# Altium project FMU3_REV_E.PrjPcb (part 2 of 2)
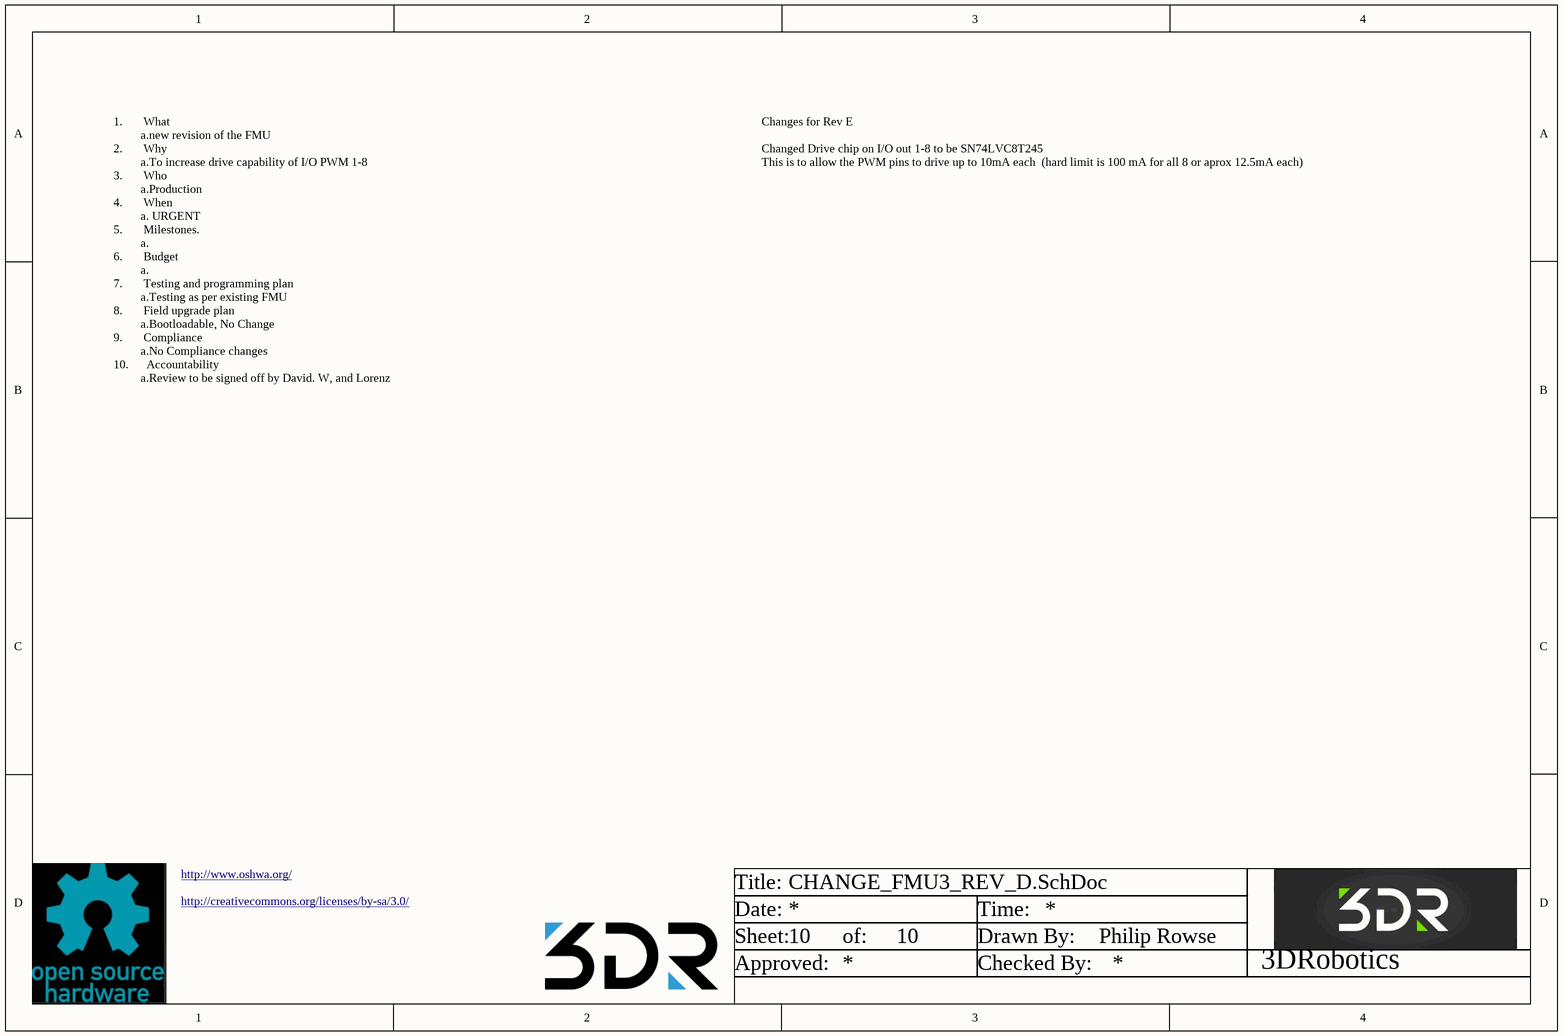
[diagram p11: CHANGE_FMU3_REV_D.SchDoc]

## Nets that join several sheets
GND: FMU_FMU3_REV_C (8 pins), SD_USB_FMU3_REV_C (9 pins), SERIAL_FMU3_REV_C (12 pins), SENSORS_FMU3_REV_C (23 pins), FMU_Power_FMU3_REV_C (25 pins), LEDs_FMU3_REV_C (Q6001.2 R6017.P$2), IO_FMU3_REV_C (15 pins), PWM_PPM_FMU3_REV_E (12 pins), 80PIN_FMU3_REV_E (6 pins), IO_PWR_FMU3_REV_C (13 pins)
~{ACCEL_MAG_EXT_CS}: FMU_FMU3_REV_C (U1001.9), SENSORS_FMU3_REV_C (U$2.2)
ALARM: FMU_FMU3_REV_C (U1001.77), 80PIN_FMU3_REV_E (U$9001.24)
AUX_BATT_CURRENT_SENS: SD_USB_FMU3_REV_C (RN2002.9), 80PIN_FMU3_REV_E (U$9001.25)
AUX_BATT_VOLTAGE_SENS: SD_USB_FMU3_REV_C (RN2002.10), 80PIN_FMU3_REV_E (U$9001.23)
~{BARO_CS}: FMU_FMU3_REV_C (U1001.88), SENSORS_FMU3_REV_C (U4003.5)
~{BARO_EXT_CS}: FMU_FMU3_REV_C (U1001.8), SENSORS_FMU3_REV_C (U$2.1)
BATT_CURRENT_SENS: FMU_FMU3_REV_C (U1001.26), SD_USB_FMU3_REV_C (RN2002.16)
BATT_CURRENT_SENS_PROT: SD_USB_FMU3_REV_C (L2001.P$1 R2004.P$1), 80PIN_FMU3_REV_E (U$9001.49)
BATT_VOLTAGE_SENS: FMU_FMU3_REV_C (U1001.25), SD_USB_FMU3_REV_C (RN2002.15)
BATT_VOLTAGE_SENS_PROT: SD_USB_FMU3_REV_C (L2002.P$1 R2003.P$1), 80PIN_FMU3_REV_E (U$9001.47)
CAN1_RX: FMU_FMU3_REV_C (U1001.81), SERIAL_FMU3_REV_C (U3004.4)
CAN1_TX: FMU_FMU3_REV_C (U1001.82), SERIAL_FMU3_REV_C (U3004.1)
CAN2_RX: FMU_FMU3_REV_C (U1001.51), SERIAL_FMU3_REV_C (U3003.4)
CAN2_TX: FMU_FMU3_REV_C (U1001.92), SERIAL_FMU3_REV_C (U3003.1)
CAN_H_1: SERIAL_FMU3_REV_C (R3010.P$1 U3004.7), 80PIN_FMU3_REV_E (U$9001.79)
CAN_H_2: SERIAL_FMU3_REV_C (R3009.P$1 U3003.7), 80PIN_FMU3_REV_E (U$9001.41)
CAN_L_1: SERIAL_FMU3_REV_C (R3010.P$2 U3004.6), 80PIN_FMU3_REV_E (U$9001.77)
CAN_L_2: SERIAL_FMU3_REV_C (R3009.P$2 U3003.6), 80PIN_FMU3_REV_E (U$9001.39)
~{EXTERN_CS}: FMU_FMU3_REV_C (U1001.36), 80PIN_FMU3_REV_E (U$9001.5)
EXTERN_DRDY: FMU_FMU3_REV_C (U1001.35), 80PIN_FMU3_REV_E (U$9001.11)
~{FMU-LED_AMBER}: FMU_FMU3_REV_C (U1001.43), LEDs_FMU3_REV_C (R6013.P$1), 80PIN_FMU3_REV_E (U$9001.2)
FMU-!RESET: FMU_Power_FMU3_REV_C (C5015.P$2 U1001.14 U5001.3), 80PIN_FMU3_REV_E (U$9001.7)
FMU-CH1: FMU_FMU3_REV_C (U1001.45), PWM_PPM_FMU3_REV_E (U8001.1)
FMU-CH1-PROT: PWM_PPM_FMU3_REV_E (RN8002.16), 80PIN_FMU3_REV_E (U$9001.50)
FMU-CH2: FMU_FMU3_REV_C (U1001.44), PWM_PPM_FMU3_REV_E (U8001.3)
FMU-CH2-PROT: PWM_PPM_FMU3_REV_E (RN8002.15), 80PIN_FMU3_REV_E (U$9001.52)
FMU-CH3: FMU_FMU3_REV_C (U1001.42), PWM_PPM_FMU3_REV_E (U8001.4)
FMU-CH3-PROT: PWM_PPM_FMU3_REV_E (RN8002.14), 80PIN_FMU3_REV_E (U$9001.54)
FMU-CH4: FMU_FMU3_REV_C (U1001.40), PWM_PPM_FMU3_REV_E (U8001.5)
FMU-CH4-PROT: PWM_PPM_FMU3_REV_E (RN8002.13), 80PIN_FMU3_REV_E (U$9001.56)
FMU-CH5: FMU_FMU3_REV_C (U1001.60), PWM_PPM_FMU3_REV_E (U8001.6)
FMU-CH5-PROT: PWM_PPM_FMU3_REV_E (RN8002.12), 80PIN_FMU3_REV_E (U$9001.58)
FMU-CH6: FMU_FMU3_REV_C (U1001.61), PWM_PPM_FMU3_REV_E (U8001.7)
FMU-CH6-PROT: PWM_PPM_FMU3_REV_E (RN8002.11), 80PIN_FMU3_REV_E (U$9001.60)
FMU-I2C1_SCL: FMU_FMU3_REV_C (U1001.95), SERIAL_FMU3_REV_C (R3002.P$1 R3007.P$1)
FMU-I2C1_SDA: FMU_FMU3_REV_C (U1001.96), SERIAL_FMU3_REV_C (R3004.P$1 R3008.P$1)
FMU-I2C2_SCL: FMU_FMU3_REV_C (U1001.47), SERIAL_FMU3_REV_C (R3001.P$1 R3005.P$1)
FMU-I2C2_SDA: FMU_FMU3_REV_C (U1001.48), SERIAL_FMU3_REV_C (R3003.P$1 R3006.P$1)
FMU-SWCLK: FMU_FMU3_REV_C (U1001.76), 80PIN_FMU3_REV_E (FMU-SWCLK.P$1 U$9001.3)
FMU-SWDIO: FMU_FMU3_REV_C (U1001.72), 80PIN_FMU3_REV_E (FMU-SWDIO.P$1 U$9001.1)
FMU-UART4_RX: FMU_FMU3_REV_C (U1001.24), SERIAL_FMU3_REV_C (U3001.8)
FMU-UART4_TX: FMU_FMU3_REV_C (U1001.23), SERIAL_FMU3_REV_C (U3001.9)
FMU-UART7_RX: FMU_FMU3_REV_C (U1001.38), SERIAL_FMU3_REV_C (U3001.4)
FMU-UART7_TX: FMU_FMU3_REV_C (U1001.39), SERIAL_FMU3_REV_C (U3001.5)
FMU-UART8_RX: FMU_FMU3_REV_C (U1001.97), SERIAL_FMU3_REV_C (U3001.6)
FMU-UART8_TX: FMU_FMU3_REV_C (U1001.98), SERIAL_FMU3_REV_C (U3001.7)
FMU-USART2_CTS: FMU_FMU3_REV_C (U1001.84), SERIAL_FMU3_REV_C (U3002.9)
FMU-USART2_RTS: FMU_FMU3_REV_C (U1001.85), SERIAL_FMU3_REV_C (U3002.8)
FMU-USART2_RX: FMU_FMU3_REV_C (U1001.87), SERIAL_FMU3_REV_C (U3002.6)
FMU-USART2_TX: FMU_FMU3_REV_C (U1001.86), SERIAL_FMU3_REV_C (U3002.7)
FMU-USART3_CTS: FMU_FMU3_REV_C (U1001.58), SERIAL_FMU3_REV_C (U3002.3)
FMU-USART3_RTS: FMU_FMU3_REV_C (U1001.59), SERIAL_FMU3_REV_C (U3002.1)
FMU-USART3_RX: FMU_FMU3_REV_C (U1001.56), SERIAL_FMU3_REV_C (U3002.4)
FMU-USART3_TX: FMU_FMU3_REV_C (U1001.55), SERIAL_FMU3_REV_C (U3002.5)
FMU-VDD_3V3: FMU_FMU3_REV_C (5 pins), SD_USB_FMU3_REV_C (6 pins), SERIAL_FMU3_REV_C (14 pins), SENSORS_FMU3_REV_C (R4002.P$2), FMU_Power_FMU3_REV_C (13 pins), IO_FMU3_REV_C (R7012.P$2), PWM_PPM_FMU3_REV_E (C8002.P$1 U8001.2 U8001.10 U8001.19), 80PIN_FMU3_REV_E (FMU-VDD_3V3.P$1)
FMU_AUX_ADC2: FMU_FMU3_REV_C (U1001.33), SD_USB_FMU3_REV_C (RN2002.8)
FMU_AUX_POWER_ADC1: FMU_FMU3_REV_C (U1001.18), SD_USB_FMU3_REV_C (RN2002.7)
~{GYRO_EXT_CS}: FMU_FMU3_REV_C (U1001.7), SENSORS_FMU3_REV_C (U$2.6)
I2C_1_SCL: SERIAL_FMU3_REV_C (R3007.P$2), 80PIN_FMU3_REV_E (U$9001.37)
I2C_1_SDA: SERIAL_FMU3_REV_C (R3008.P$2), 80PIN_FMU3_REV_E (U$9001.35)
I2C_2_SCL: SERIAL_FMU3_REV_C (R3005.P$2), 80PIN_FMU3_REV_E (U$9001.6)
I2C_2_SDA: SERIAL_FMU3_REV_C (R3006.P$2), 80PIN_FMU3_REV_E (U$9001.4)
I/O_POWER_BREATHING: LEDs_FMU3_REV_C (R6001.P$2), IO_FMU3_REV_C (U7001.32)
~{IO-LED_AMBER}: LEDs_FMU3_REV_C (R6015.P$1), IO_FMU3_REV_C (U7001.28)
~{IO-LED_SAFET_PROT}: LEDs_FMU3_REV_C (R6016.P$1), 80PIN_FMU3_REV_E (U$9001.28)
~{IO-LED_SAFETY}: LEDs_FMU3_REV_C (R6016.P$2), IO_FMU3_REV_C (U7001.26)
IMU_TEMPERATURE_CONTROL: SENSORS_FMU3_REV_C (U$2.9), IO_FMU3_REV_C (U7001.27)
IO-!RESET: IO_FMU3_REV_C (C7001.P$2 U7001.7), 80PIN_FMU3_REV_E (U$9001.75), IO_PWR_FMU3_REV_C (U10002.3)
IO-!VDD_SERVO_IN_FAULT: IO_FMU3_REV_C (U7001.38), IO_PWR_FMU3_REV_C (U10001.4)
IO-CH1: IO_FMU3_REV_C (U7001.10), PWM_PPM_FMU3_REV_E (U8002.10)
IO-CH1-PROT: PWM_PPM_FMU3_REV_E (RN8001.9), 80PIN_FMU3_REV_E (U$9001.80)
IO-CH2: IO_FMU3_REV_C (U7001.11), PWM_PPM_FMU3_REV_E (U8002.9)
IO-CH2-PROT: PWM_PPM_FMU3_REV_E (RN8001.10), 80PIN_FMU3_REV_E (U$9001.78)
IO-CH3: IO_FMU3_REV_C (U7001.45), PWM_PPM_FMU3_REV_E (U8002.8)
IO-CH3-PROT: PWM_PPM_FMU3_REV_E (RN8001.11), 80PIN_FMU3_REV_E (U$9001.76)
IO-CH4: IO_FMU3_REV_C (U7001.46), PWM_PPM_FMU3_REV_E (U8002.7)
IO-CH4-PROT: PWM_PPM_FMU3_REV_E (RN8001.12), 80PIN_FMU3_REV_E (U$9001.74)
IO-CH5: IO_FMU3_REV_C (U7001.16), PWM_PPM_FMU3_REV_E (U8002.6)
IO-CH5-PROT: PWM_PPM_FMU3_REV_E (RN8001.13), 80PIN_FMU3_REV_E (U$9001.72)
IO-CH6: IO_FMU3_REV_C (U7001.17), PWM_PPM_FMU3_REV_E (U8002.5)
IO-CH6-PROT: PWM_PPM_FMU3_REV_E (RN8001.14), 80PIN_FMU3_REV_E (U$9001.70)
IO-CH7: IO_FMU3_REV_C (U7001.18), PWM_PPM_FMU3_REV_E (U8002.4)
IO-CH7-PROT: PWM_PPM_FMU3_REV_E (RN8001.15), 80PIN_FMU3_REV_E (U$9001.68)
IO-CH8: IO_FMU3_REV_C (U7001.19), PWM_PPM_FMU3_REV_E (U8002.3)
IO-CH8-PROT: PWM_PPM_FMU3_REV_E (RN8001.16), 80PIN_FMU3_REV_E (U$9001.66)
IO-SWCLK: IO_FMU3_REV_C (U7001.37), 80PIN_FMU3_REV_E (IO-SWCLK.P$1 U$9001.71)
IO-SWDIO: IO_FMU3_REV_C (U7001.34), 80PIN_FMU3_REV_E (IO-SWDIO.P$1 U$9001.69)
IO-USART1_RX_SPECTRUM_DSM: IO_FMU3_REV_C (R7013.P$2 U7001.31), 80PIN_FMU3_REV_E (U$9001.48)
IO-USART1_TX: FMU_FMU3_REV_C (R1001.P$2), IO_FMU3_REV_C (U7001.30), 80PIN_FMU3_REV_E (U$9001.46)
IO-VDD_3V3: IO_FMU3_REV_C (8 pins), PWM_PPM_FMU3_REV_E (5 pins), 80PIN_FMU3_REV_E (IO-VDD_3V3.P$1 U$9001.26), IO_PWR_FMU3_REV_C (C10004.P$1 C10005.P$1 U10002.7)
IO-VDD_5V5: LEDs_FMU3_REV_C (13 pins), PWM_PPM_FMU3_REV_E (JP1.3), 80PIN_FMU3_REV_E (U$9001.65), IO_PWR_FMU3_REV_C (5 pins)
Level_Shift Enable: FMU_FMU3_REV_C (R1020.P$1 R1021.P$2 R1022.P$2), SERIAL_FMU3_REV_C (U3001.10 U3002.10)
~{MPU_CS}: FMU_FMU3_REV_C (U1001.17), SENSORS_FMU3_REV_C (U4001.8), 80PIN_FMU3_REV_E (U405.22)
~{MPU_EXT_CS}: FMU_FMU3_REV_C (U1001.3), SENSORS_FMU3_REV_C (U$2.5)
MPU_DRDY: FMU_FMU3_REV_C (U1001.62), SENSORS_FMU3_REV_C (U4001.12), 80PIN_FMU3_REV_E (U405.12)
OTG_FS_N: FMU_FMU3_REV_C (U1001.70), SD_USB_FMU3_REV_C (U2001.6)
OTG_FS_P: FMU_FMU3_REV_C (U1001.71), SD_USB_FMU3_REV_C (U2001.4)
OTG_N: SD_USB_FMU3_REV_C (J2001.D- U2001.1), 80PIN_FMU3_REV_E (U$9001.33)
OTG_P: SD_USB_FMU3_REV_C (J2001.D+ U2001.3), 80PIN_FMU3_REV_E (U$9001.31)
PPM-SBUS-PROT: PWM_PPM_FMU3_REV_E (RN8002.10), 80PIN_FMU3_REV_E (U$9001.62)
PPM_INPUT: IO_FMU3_REV_C (U7001.29), PWM_PPM_FMU3_REV_E (D8001.C U8001.8 U8003.2)
PRESSURE_SENS: FMU_FMU3_REV_C (U1001.34), SD_USB_FMU3_REV_C (RN2002.5)
PRESSURE_SENS_IN: SD_USB_FMU3_REV_C (RN2002.12), 80PIN_FMU3_REV_E (U$9001.21)
PROT_SPARE_1: SERIAL_FMU3_REV_C (RN3002.16), 80PIN_FMU3_REV_E (U$9001.8)
PROT_SPARE_2: SERIAL_FMU3_REV_C (RN3002.15), 80PIN_FMU3_REV_E (U$9001.10)
RSSI_IN: IO_FMU3_REV_C (U7001.15 U7001.33), PWM_PPM_FMU3_REV_E (R8001.P$1)
S.BUS_OUT: PWM_PPM_FMU3_REV_E (RN8002.9), 80PIN_FMU3_REV_E (U$9001.64)
~{SBUS_OUTPUT_EN}: IO_FMU3_REV_C (U7001.40), PWM_PPM_FMU3_REV_E (U8003.7)
SAFETY: LEDs_FMU3_REV_C (R6017.P$1), IO_FMU3_REV_C (U7001.41), 80PIN_FMU3_REV_E (U$9001.17)
SBUS_INPUT: IO_FMU3_REV_C (U7001.22), PWM_PPM_FMU3_REV_E (U8003.6)
SBUS_OUTPUT: IO_FMU3_REV_C (U7001.21), PWM_PPM_FMU3_REV_E (U8003.5)
SDIO_CK: FMU_FMU3_REV_C (U1001.80), SD_USB_FMU3_REV_C (U2002.5)
SDIO_CMD: FMU_FMU3_REV_C (U1001.83), SD_USB_FMU3_REV_C (RN2001.1 U2002.3)
SDIO_D0: FMU_FMU3_REV_C (U1001.65), SD_USB_FMU3_REV_C (RN2001.5 U2002.7)
SDIO_D1: FMU_FMU3_REV_C (U1001.66), SD_USB_FMU3_REV_C (RN2001.4 U2002.8)
SDIO_D2: FMU_FMU3_REV_C (U1001.78), SD_USB_FMU3_REV_C (RN2001.3 U2002.1)
SDIO_D3: FMU_FMU3_REV_C (U1001.79), SD_USB_FMU3_REV_C (RN2001.2 U2002.2)
SERIAL1_CTS: SERIAL_FMU3_REV_C (RN3001.9), 80PIN_FMU3_REV_E (U$9001.44)
SERIAL1_RTS: SERIAL_FMU3_REV_C (RN3001.10), 80PIN_FMU3_REV_E (U$9001.42)
SERIAL1_RX: SERIAL_FMU3_REV_C (RN3001.12), 80PIN_FMU3_REV_E (U$9001.38)
SERIAL1_TX: SERIAL_FMU3_REV_C (RN3001.11), 80PIN_FMU3_REV_E (U$9001.40)
SERIAL2_CTS: SERIAL_FMU3_REV_C (RN3001.15), 80PIN_FMU3_REV_E (U$9001.32)
SERIAL2_RTS: SERIAL_FMU3_REV_C (RN3001.16), 80PIN_FMU3_REV_E (U$9001.30)
SERIAL2_RX: SERIAL_FMU3_REV_C (RN3001.14), 80PIN_FMU3_REV_E (U$9001.34)
SERIAL2_TX: SERIAL_FMU3_REV_C (RN3001.13), 80PIN_FMU3_REV_E (U$9001.36)
SERIAL3_RX: SERIAL_FMU3_REV_C (RN3002.10), 80PIN_FMU3_REV_E (U$9001.20)
SERIAL3_TX: SERIAL_FMU3_REV_C (RN3002.9), 80PIN_FMU3_REV_E (U$9001.22)
SERIAL4_RX: SERIAL_FMU3_REV_C (RN3002.12), 80PIN_FMU3_REV_E (U$9001.16)
SERIAL4_TX: SERIAL_FMU3_REV_C (RN3002.11), 80PIN_FMU3_REV_E (U$9001.18)
SERIAL5_RX: SERIAL_FMU3_REV_C (RN3002.14), 80PIN_FMU3_REV_E (RX5.P$1 U$9001.12)
SERIAL5_TX: SERIAL_FMU3_REV_C (RN3002.13), 80PIN_FMU3_REV_E (TX5.P$1 U$9001.14)
SERIAL_FMU_TO_IO: FMU_FMU3_REV_C (U1001.63), IO_FMU3_REV_C (R7004.P$2)
SERIAL_IO_TO_FMU: FMU_FMU3_REV_C (U1001.64), IO_FMU3_REV_C (R7003.P$2)
SPI_EXT_MISO: FMU_FMU3_REV_C (U1001.4), SENSORS_FMU3_REV_C (U$2.14), 80PIN_FMU3_REV_E (U$9001.67)
SPI_EXT_MOSI: FMU_FMU3_REV_C (U1001.5), SENSORS_FMU3_REV_C (U$2.10), 80PIN_FMU3_REV_E (U$9001.51)
SPI_EXT_SCK: FMU_FMU3_REV_C (U1001.1), SENSORS_FMU3_REV_C (U$2.18), 80PIN_FMU3_REV_E (U$9001.73)
SPI_INT_MAG_!CS: FMU_FMU3_REV_C (U1001.16), SENSORS_FMU3_REV_C (U4002.4)
SPI_INT_MISO: FMU_FMU3_REV_C (U1001.31), SENSORS_FMU3_REV_C (U4001.9 U4002.5 U4003.6), 80PIN_FMU3_REV_E (U405.9)
SPI_INT_MOSI: FMU_FMU3_REV_C (U1001.32), SENSORS_FMU3_REV_C (U4001.24 U4002.16 U4003.7), 80PIN_FMU3_REV_E (U405.24)
SPI_INT_SCK: FMU_FMU3_REV_C (U1001.30), SENSORS_FMU3_REV_C (U4001.23 U4002.1 U4003.8), 80PIN_FMU3_REV_E (U405.23)
~{VBUS_VALID}: FMU_FMU3_REV_C (U1001.15), 80PIN_FMU3_REV_E (U$9001.59)
~{VDD_5V_HIPOWER_OC}: FMU_FMU3_REV_C (U1001.41), 80PIN_FMU3_REV_E (U$9001.45)
~{VDD_5V_PERIPH_EN}: FMU_FMU3_REV_C (U1001.67), 80PIN_FMU3_REV_E (U$9001.27)
~{VDD_5V_PERIPH_OC}: FMU_FMU3_REV_C (U1001.46), 80PIN_FMU3_REV_E (U$9001.43)
~{VDD_BACKUP_VALID}: FMU_FMU3_REV_C (U1001.93), IO_FMU3_REV_C (R7011.P$2), 80PIN_FMU3_REV_E (U$9001.57)
~{VDD_BRICK_VALID}: FMU_FMU3_REV_C (U1001.91), IO_FMU3_REV_C (R7010.P$2), 80PIN_FMU3_REV_E (U$9001.55)
VBAT: FMU_Power_FMU3_REV_C (C5100.2 C5101.2 R5005.P$1 U1001.6), IO_FMU3_REV_C (U7001.1)
VBUS: FMU_FMU3_REV_C (U1001.68), SD_USB_FMU3_REV_C (J2001.VBUS U2001.5), 80PIN_FMU3_REV_E (U$9001.29)
VDD_3V3_SENSORS: SENSORS_FMU3_REV_C (14 pins), FMU_Power_FMU3_REV_C (C5007.P$1 C5008.P$1 Q5001.E U5001.8), 80PIN_FMU3_REV_E (U405.1 U405.8 U405.13)
VDD_3V3_SENSORS_EN: FMU_FMU3_REV_C (U1001.2), FMU_Power_FMU3_REV_C (R5001.P$2 R5002.P$2 U5001.5)
VDD_3V3_SPEKTRUM_EN: IO_FMU3_REV_C (U7001.2), 80PIN_FMU3_REV_E (U$9001.19)
VDD_5V_IN: SD_USB_FMU3_REV_C (RN2002.3), FMU_Power_FMU3_REV_C (L5001.P$1), LEDs_FMU3_REV_C (LED6010.A), 80PIN_FMU3_REV_E (5v.P$1 U$9001.61 U$9001.63), IO_PWR_FMU3_REV_C (F10001.1)
VDD_5V_SENS: FMU_FMU3_REV_C (U1001.29), SD_USB_FMU3_REV_C (RN2002.13 RN2002.14)
VDD_SERVO: SD_USB_FMU3_REV_C (R2001.P$2), 80PIN_FMU3_REV_E (U$9001.53)
VDD_SERVO_IN: 80PIN_FMU3_REV_E (U$9001.9), IO_PWR_FMU3_REV_C (U10001.1)
VDD_SERVO_SENS: SD_USB_FMU3_REV_C (R2002.P$1 RN2002.11), IO_FMU3_REV_C (U7001.14)

## Assembly variants
FMU3_REV_D: not fitted 3DR Logo 5v FMU-SWCLK FMU-SWDIO FMU-VDD_3V3 IO-SWCLK IO-SWDIO IO-VDD_3V3 M3_MOUNT1001 M3_MOUNT1003 M3_MOUNT1004 R1020 R1021 R7013 RX5 TX5 U$4